# Altium schematic sheet usb1uart.SchDoc
size A4
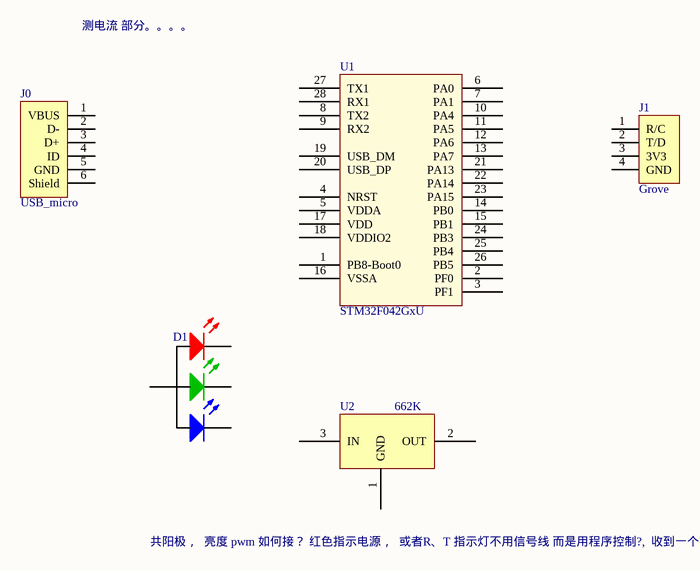
[diagram p0: usb1uart.SchDoc]

## Parts
D1  (no value)
J0  USB_micro  [USB_MICRO]
J1  Grove  [S4B-PH-SM4]
U1  STM32F042GxU
U2  662K  [SOT223]

## Nets

Not connected (* = marked no-connect by the designer): D1 1(A) 2(K); J0 1(VBUS) 2(D-) 3(D+) 4(ID) 5(GND) 6(Shield); J1 1(R/C) 2(T/D) 3(3V3) 4(GND); U1 1(PB8-Boot0) 2(PF0) 3(PF1) 4(NRST) 5(VDDA) 6(PA0) 7(PA1) 8(TX2) 9(RX2) 10(PA4) 11(PA5) 12(PA6) 13(PA7) 14(PB0) 15(PB1) 16(VSSA) 17(VDD) 18(VDDIO2) 19(USB_DM) 20(USB_DP) 21(PA13) 22(PA14) 23(PA15) 24(PB3) 25(PB4) 26(PB5) 27(TX1) 28(RX1); U2 1(GND) 2(OUT) 3(IN)

## Notes on the sheet
- 测电流 部分。。。。
- 共阳极，  亮度 pwm 如何接？ 红色指示电源，  或者R、T 指示灯不用信号线 而是用程序控制?,  收到一个字节闪一次，这样可以 精细控制

## Library data of the parts
D1 = LED-RGB-CA: common anode 共阳极